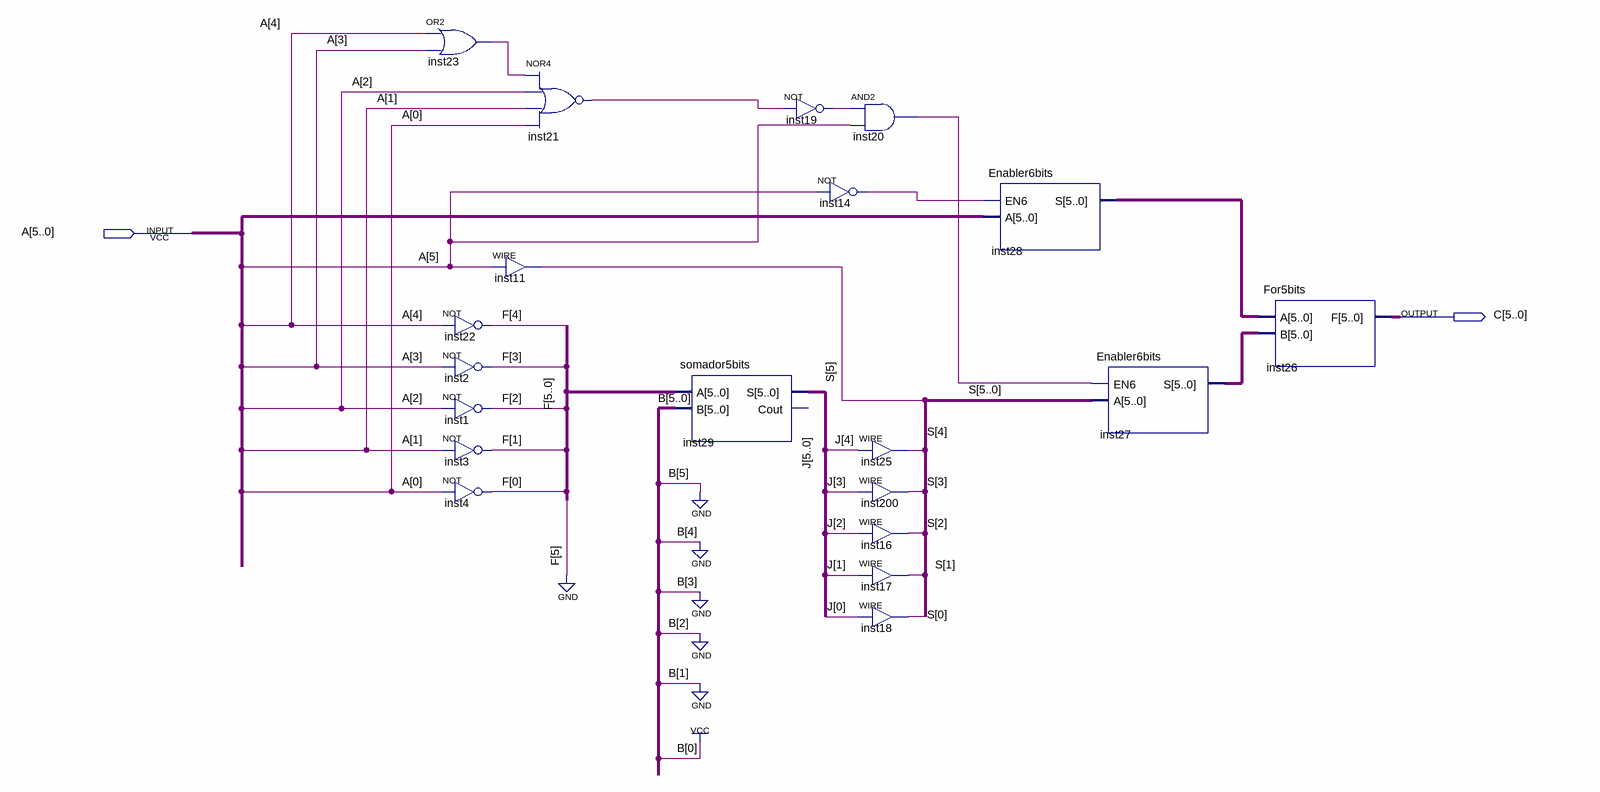
[diagram p0: schematic sheet]
// Quartus schematic Complementoa2_6bits.bdf as structural Verilog: 20 symbols, 2 pins
module Complementoa2_6bits (
  input  [5:0] A,
  output [5:0] C
);

  wire inst14_out, inst19_out, inst20_out, inst21_out, inst23_out;
  wire [4:0] F;
  wire [5:0] inst27_s, inst28_s, J, S;

  or inst23 (inst23_out, A[4], A[3]);
  assign S[5] = A[5];  // WIRE inst11
  not inst22 (F[4], A[4]);
  not inst2 (F[3], A[3]);
  not inst1 (F[2], A[2]);
  not inst3 (F[1], A[1]);
  not inst4 (F[0], A[0]);
  nor inst21 (inst21_out, inst23_out, A[2], A[1], A[0]);
  somador5bits inst29 (.A({1'b0, F}), .B(6'b000001), .S(J));  // open: Cout
  not inst19 (inst19_out, inst21_out);
  not inst14 (inst14_out, A[5]);
  and inst20 (inst20_out, inst19_out, A[5]);
  assign S[4] = J[4];  // WIRE inst25
  assign S[3] = J[3];  // WIRE inst200
  assign S[2] = J[2];  // WIRE inst16
  assign S[1] = J[1];  // WIRE inst17
  assign S[0] = J[0];  // WIRE inst18
  Enabler6bits inst28 (.EN6(inst14_out), .A(A), .S(inst28_s));
  Enabler6bits inst27 (.EN6(inst20_out), .A(S), .S(inst27_s));
  For5bits inst26 (.A(inst28_s), .B(inst27_s), .F(C));
endmodule
